# Altium project Dragonflyte.PrjPcb (part 2 of 2)

## Sheet UWB.SchDoc
size A
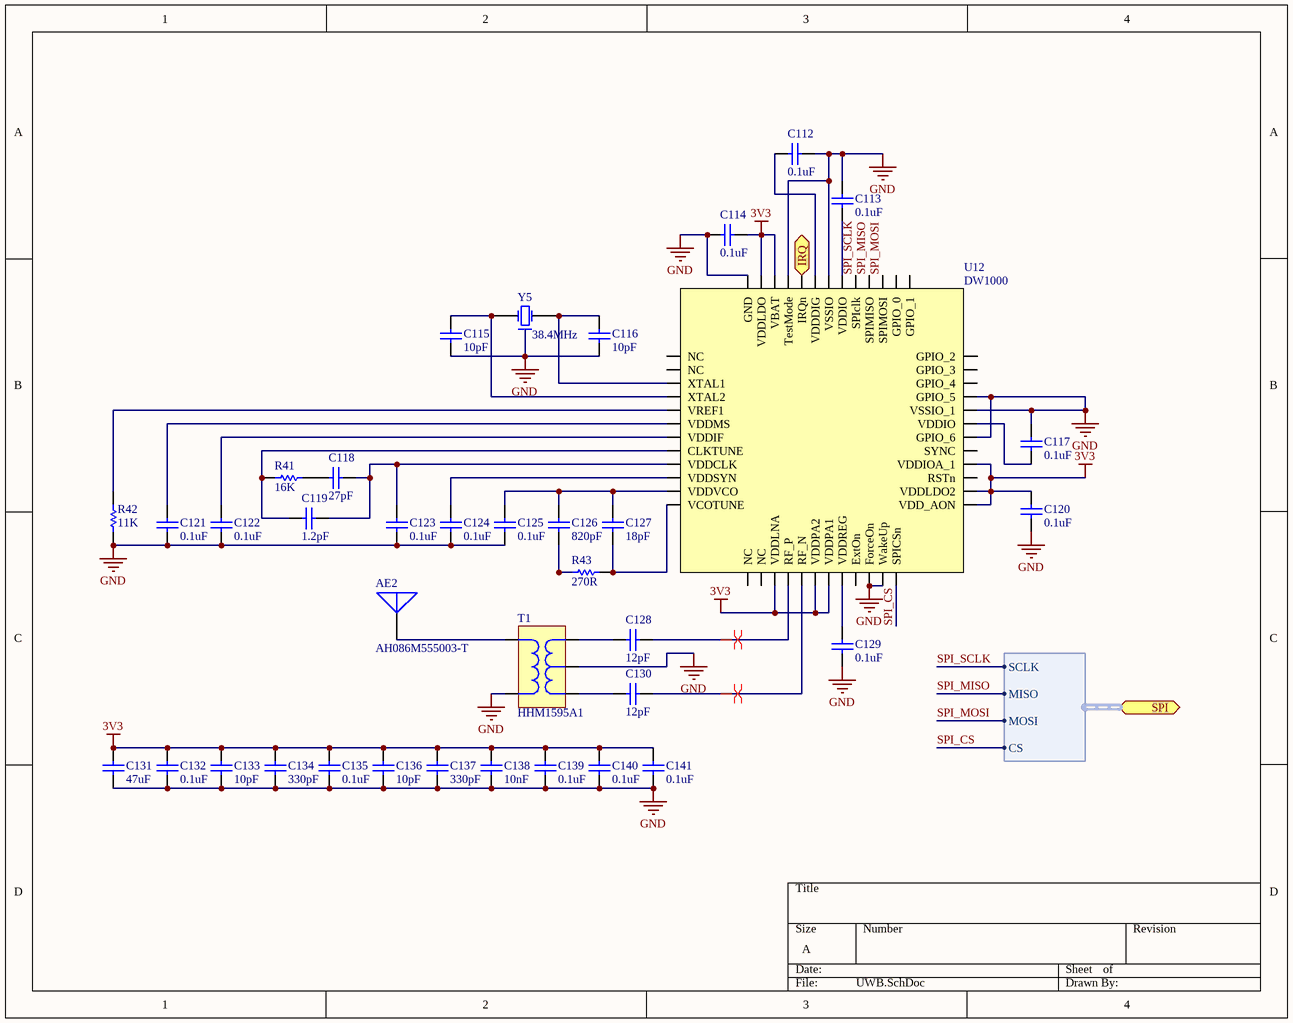
[diagram p8: UWB.SchDoc]

### Parts
AE2  AH086M555003-T  [AH086M555003-T]
C112  value 0.1uF  [C0402[1005X55]]  (hidden comment: 0.1uF 6.3V 0402)
C113  value 0.1uF  [C0402[1005X55]]  (hidden comment: 0.1uF 6.3V 0402)
C114  value 0.1uF  [C0402[1005X55]]  (hidden comment: 0.1uF 6.3V 0402)
C115  value 10pF  [C0402[1005X55]]  (hidden comment: 10pF 50V 0402)
C116  value 10pF  [C0402[1005X55]]  (hidden comment: 10pF 50V 0402)
C117  value 0.1uF  [C0402[1005X55]]  (hidden comment: 0.1uF 6.3V 0402)
C118  value 27pF  [C0402[1005X55]]  (hidden comment: 27pF 50V 0402)
C119  value 1.2pF  [C0402[1005X55]]  (hidden comment: 1.2pF 50V 0402)
C120  value 0.1uF  [C0402[1005X55]]  (hidden comment: 0.1uF 6.3V 0402)
C121  value 0.1uF  [C0402[1005X55]]  (hidden comment: 0.1uF 6.3V 0402)
C122  value 0.1uF  [C0402[1005X55]]  (hidden comment: 0.1uF 6.3V 0402)
C123  value 0.1uF  [C0402[1005X55]]  (hidden comment: 0.1uF 6.3V 0402)
C124  value 0.1uF  [C0402[1005X55]]  (hidden comment: 0.1uF 6.3V 0402)
C125  value 0.1uF  [C0402[1005X55]]  (hidden comment: 0.1uF 6.3V 0402)
C126  value 820pF  [C0402[1005X55]]  (hidden comment: 820pF 50V 0402)
C127  value 18pF  [C0402[1005X55]]  (hidden comment: 18pF 50V 0402)
C128  value 12pF  [C0402[1005X55]]  (hidden comment: 12pF 50V 0402)
C129  value 0.1uF  [C0402[1005X55]]  (hidden comment: 0.1uF 6.3V 0402)
C130  value 12pF  [C0402[1005X55]]  (hidden comment: 12pF 50V 0402)
C131  value 47uF  [C1206[3216X160]]  (hidden comment: 47uF 6.3V 1206)
C132  value 0.1uF  [C0402[1005X55]]  (hidden comment: 0.1uF 6.3V 0402)
C133  value 10pF  [C0402[1005X55]]  (hidden comment: 10pF 50V 0402)
C134  value 330pF  [C0402[1005X55]]  (hidden comment: 330pF 50V 0402)
C135  value 0.1uF  [C0402[1005X55]]  (hidden comment: 0.1uF 6.3V 0402)
C136  value 10pF  [C0402[1005X55]]  (hidden comment: 10pF 50V 0402)
C137  value 330pF  [C0402[1005X55]]  (hidden comment: 330pF 50V 0402)
C138  value 10nF  [C0402[1005X55]]  (hidden comment: 10nF 50V 0402)
C139  value 0.1uF  [C0402[1005X55]]  (hidden comment: 0.1uF 6.3V 0402)
C140  value 0.1uF  [C0402[1005X55]]  (hidden comment: 0.1uF 6.3V 0402)
C141  value 0.1uF  [C0402[1005X55]]  (hidden comment: 0.1uF 6.3V 0402)
R41  value 16K  [R0402[1005]]  (hidden comment: 16K 1% 0402)
R42  value 11K  [R0402[1005]]  (hidden comment: 11K 1% 0402)
R43  value 270R  [R0402[1005]]  (hidden comment: 270R 1% 0402)
T1  HHM1595A1  [HHM1595A1]
U12  DW1000  [QFN-48]
Y5  38.4MHz  [ABRA-ABM10]

### Ports
IRQ (out), SPI (harness SPI)

### Harnesses
SPI: SCLK, MISO, MOSI, CS

### Nets
3V3: C114.1 C120.2 C131.2 C132.2 C133.2 C134.2 C135.2 C136.2 C137.2 C138.2 C139.2 C140.2 C141.2 U12.15(VDDLNA) U12.18(VDDPA2) U12.19(VDDPA1) U12.25(VDD_AON) U12.26(VDDLDO2) U12.28(VDDIOA_1) U12.47(VBAT) U12.48(VDDLDO)
GND: C112.1 C113.2 C114.2 C115.1 C116.1 C117.2 C120.1 C121.1 C122.1 C123.1 C124.1 C125.1 C129.1 C131.1 C132.1 C133.1 C134.1 C135.1 C136.1 C137.1 C138.1 C139.1 C140.1 C141.1 R42.1 T1.2 T1.5 U12.22(ForceOn) U12.23(WakeUp) U12.30(GPIO_6) U12.32(VSSIO_1) U12.33(GPIO_5) U12.43(VSSIO) U12.46(TestMode) U12.49(GND) Y5.2
SPI_CS: U12.24(SPICSn) ; port SPI.CS
SPI_MISO: U12.40(SPIMISO) ; port SPI.MISO
SPI_MOSI: U12.39(SPIMOSI) ; port SPI.MOSI
SPI_SCLK: U12.41(SPIclk) ; port SPI.SCLK
NetAE2_1: AE2.1 T1.1
NetC112_2: C112.2 U12.44(VDDDIG)
NetC113_1: C113.1 U12.42(VDDIO)
NetC115_2: C115.2 U12.4(XTAL2) Y5.1(X1)
NetC116_2: C116.2 U12.3(XTAL1) Y5.3(X2)
NetC117_1: C117.1 U12.31(VDDIO)
NetC118_1: C118.1 C119.1 C123.2 U12.9(VDDCLK)
NetC118_2: C118.2 R41.1
NetC119_2: C119.2 R41.2 U12.8(CLKTUNE)
NetC121_2: C121.2 U12.6(VDDMS)
NetC122_2: C122.2 U12.7(VDDIF)
NetC124_2: C124.2 U12.10(VDDSYN)
NetC125_2: C125.2 C126.2 C127.2 U12.11(VDDVCO)
NetC126_1: C126.1 R43.1
NetC127_1: C127.1 R43.2 U12.12(VCOTUNE)
NetC128_1: C128.1 T1.4
NetC128_2: C128.2 U12.16(RF_P)
NetC129_2: C129.2 U12.20(VDDREG)
NetC130_1: C130.1 T1.3
NetC130_2: C130.2 U12.17(RF_N)
NetR42_2: R42.2 U12.5(VREF1)
NetU1_A16: U12.45(IRQn) ; port IRQ

Not connected (* = marked no-connect by the designer): U12 1(NC) 2(NC) 13(NC) 14(NC) 21(ExtOn) 27(RSTn) 29(SYNC) 34(GPIO_4) 35(GPIO_3) 36(GPIO_2) 37(GPIO_1) 38(GPIO_0)

### Layout directives
differential pair: NetC128_2, NetC130_2

### Library data of the parts
AE2 = AH086M555003-T: Manufacturer: Taiyo Yuden; PartNumber: AH086M555003-T; Mounting Technology: Surface Mount
C112-C114 C117 C120-C125 C129 C132 C135 C139-C141 = CAP_0.1uF_6.3V_0402_10%: 0.1uF 6.3V 10% 0402 (1005 Metric); PartNumber: GRM155R70J104KA01D; Manufacturer: Murata; Mounting Technology: Surface Mount; PackageReference: 0402; PackageDescription: 0402 (1005 Metric); Voltage: 6.3V; Tolerance: 10%
C115 C116 C133 C136 = CAP_10pF_50V_0402_1%: 10pF 50V 1% 0402 (1005 Metric); PartNumber: GRM1555C1H100FA01D; Manufacturer: Murata; Mounting Technology: Surface Mount; PackageReference: 0402; PackageDescription: 0402 (1005 Metric); Voltage: 50V; Tolerance: 1%
C118 = CAP_27pF_50V_0402_1%: 27pF 50V 1% 0402 (1005 Metric); PartNumber: GRM1555C1H270FA01D; Manufacturer: Murata; Mounting Technology: Surface Mount; PackageReference: 0402; PackageDescription: 0402 (1005 Metric); Voltage: 50V; Tolerance: 1%
C119 = CAP_1.2pF_50V_0402_0.05pF: 1.2pF 50V 0.05pF 0402 (1005 Metric); PartNumber: GRM1555C1H1R2WA01D; Manufacturer: Murata; Mounting Technology: Surface Mount; PackageReference: 0402; PackageDescription: 0402 (1005 Metric); Voltage: 50V; Tolerance: 0.05pF
C126 = CAP_820pF_50V_0402_5%: 820pF 50V 5% 0402 (1005 Metric); PartNumber: GRM1555C1H821JA01D; Manufacturer: Murata; Mounting Technology: Surface Mount; PackageReference: 0402; PackageDescription: 0402 (1005 Metric); Voltage: 50V; Tolerance: 5%
C127 = CAP_18pF_50V_0402_1%: 18pF 50V 1% 0402 (1005 Metric); PartNumber: GRM1555C1H180FA01D; Manufacturer: Murata; Mounting Technology: Surface Mount; PackageReference: 0402; PackageDescription: 0402 (1005 Metric); Voltage: 50V; Tolerance: 1%
C128 C130 = CAP_12pF_50V_0402_5%: 12pF 50V 5% 0402 (1005 Metric); PartNumber: GRM1555C1H120JA01D; Manufacturer: Murata; Mounting Technology: Surface Mount; PackageReference: 0402; PackageDescription: 0402 (1005 Metric); Voltage: 50V; Tolerance: 5%
C131 = CAP_47uF_6.3V_1206_10%: 47uF 6.3V 10% 1206 (3216 Metric); PartNumber: GRM31CR60J476KE19L; Manufacturer: Murata; Mounting Technology: Surface Mount; PackageReference: 1206; PackageDescription: 1206 (3216 Metric); Voltage: 6.3V; Tolerance: 10%
C134 C137 = CAP_330pF_50V_0402_5%: 330pF 50V 5% 0402 (1005 Metric); PartNumber: GRM1555C1H331JA01D; Manufacturer: Murata; Mounting Technology: Surface Mount; PackageReference: 0402; PackageDescription: 0402 (1005 Metric); Voltage: 50V; Tolerance: 5%
C138 = CAP_10nF_50V_0402_10%: 10nF 50V 10% 0402 (1005 Metric); PartNumber: GCM155R71H103KA55D; Manufacturer: Murata; Mounting Technology: Surface Mount; PackageReference: 0402; PackageDescription: 0402 (1005 Metric); Voltage: 50V; Tolerance: 10%
R41 = RES_16K_0402_1%: 16K 0.063W 1% 0402 (1005 Metric); Manufacturer: KOA Speer; PartNumber: RK73H1ETTP1602F; Tolerance: 1%; Power: 0.063W; Mounting Technology: Surface Mount; PackageReference: 0402; PackageDescription: 0402 (1005 Metric); ComponentLink1Description: Datasheet; ComponentLink1URL: http://www.koaspeer.com/catimages/Products/RK73H/RK73H.pdf
R42 = RES_11K_0402_1%: 11K 0.063W 1% 0402 (1005 Metric); Manufacturer: KOA Speer; PartNumber: RK73H1ETTP1102F; Tolerance: 1%; Power: 0.063W; Mounting Technology: Surface Mount; PackageReference: 0402; PackageDescription: 0402 (1005 Metric); ComponentLink1Description: Datasheet; ComponentLink1URL: http://www.koaspeer.com/catimages/Products/RK73H/RK73H.pdf
R43 = RES_270R_0402_1%: 270R 0.063W 1% 0402 (1005 Metric); Manufacturer: KOA Speer; PartNumber: RK73H1ETTP2700F; Tolerance: 1%; Power: 0.063W; Mounting Technology: Surface Mount; PackageReference: 0402; PackageDescription: 0402 (1005 Metric); ComponentLink1Description: Datasheet; ComponentLink1URL: http://www.koaspeer.com/catimages/Products/RK73H/RK73H.pdf
T1 = HHM1595A1: Manufacturer: TDK; PartNumber: HHM1595A1; PackageReference: 0805; Mounting Technology: Surface Mount
U12 = DW1000: UWB DW1000; Part Number: DW1000-I-TR13; Manufacturer: Decawave Limited; PackageReference: QFN-48; Mounting Technology: Surface Mount
Y5 = ABM10-165-38.400MHZ-T3: Manufacturer: ABRACON; PartNumber: ABM10-165-38.400MHZ-T3; Mounting Technology: Surface Mount; PackageReference: 4-SMD; PackageDescription: 4-SMD, No Lead (DFN, LCC)

## Sheet MicrophoneArray.SchDoc
size A
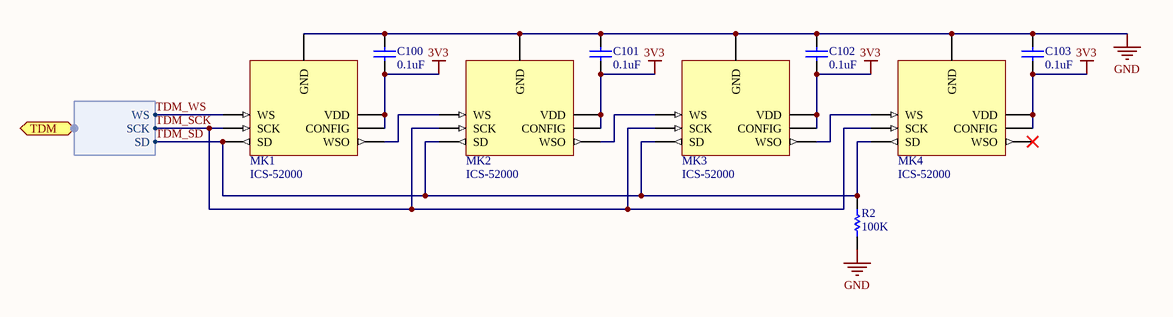
[diagram p9: MicrophoneArray.SchDoc]

### Parts
C100  value 0.1uF  [C0402[1005X55]]  (hidden comment: 0.1uF 6.3V 0402)
C101  value 0.1uF  [C0402[1005X55]]  (hidden comment: 0.1uF 6.3V 0402)
C102  value 0.1uF  [C0402[1005X55]]  (hidden comment: 0.1uF 6.3V 0402)
C103  value 0.1uF  [C0402[1005X55]]  (hidden comment: 0.1uF 6.3V 0402)
MK1  ICS-52000  [MIC]
MK2  ICS-52000  [MIC]
MK3  ICS-52000  [MIC]
MK4  ICS-52000  [MIC]
R2  value 100K  [R0402[1005]]  (hidden comment: 100K 1% 0402)

### Ports
TDM (harness TDM)

### Harnesses
TDM: WS, SCK, SD

### Nets
3V3: C100.1 C101.1 C102.1 C103.1 MK1.2(CONFIG) MK1.3(VDD) MK2.2(CONFIG) MK2.3(VDD) MK3.2(CONFIG) MK3.3(VDD) MK4.2(CONFIG) MK4.3(VDD)
GND: C100.2 C101.2 C102.2 C103.2 MK1.4(GND) MK2.4(GND) MK3.4(GND) MK4.4(GND) R2.1
TDM_SCK: MK1.6(SCK) MK2.6(SCK) MK3.6(SCK) MK4.6(SCK) ; port TDM.SCK
TDM_SD: MK1.7(SD) MK2.7(SD) MK3.7(SD) MK4.7(SD) R2.2 ; port TDM.SD
TDM_WS: MK1.5(WS) ; port TDM.WS
NetMK1_1: MK1.1(WSO) MK2.5(WS)
NetMK2_1: MK2.1(WSO) MK3.5(WS)
NetMK3_1: MK3.1(WSO) MK4.5(WS)

Not connected (* = marked no-connect by the designer): MK4 1(WSO)*

### Library data of the parts
C100-C103 = CAP_0.1uF_6.3V_0402_10%: as C112 on sheet UWB; Mounting Technology: Surface Mount; PackageReference: 0402; PackageDescription: 0402 (1005 Metric); Voltage: 6.3V; Tolerance: 10%
MK1-MK4 = ICS-52000: MIC MEMS DIGITAL OMNI -26DB; Manufacturer: TDK InvenSense; PartNumber: ICS-52000; Mounting Technology: Surface Mount
R2 = RES_100K_0402_1%: 100K 0.063W 1% 0402 (1005 Metric); Manufacturer: KOA Speer; PartNumber: RK73H1ETTP1003F; Tolerance: 1%; Power: 0.063W; Mounting Technology: Surface Mount; PackageReference: 0402; PackageDescription: 0402 (1005 Metric); ComponentLink1Description: Datasheet; ComponentLink1URL: http://www.koaspeer.com/catimages/Products/RK73H/RK73H.pdf

## Sheet Cameras.SchDoc
size B
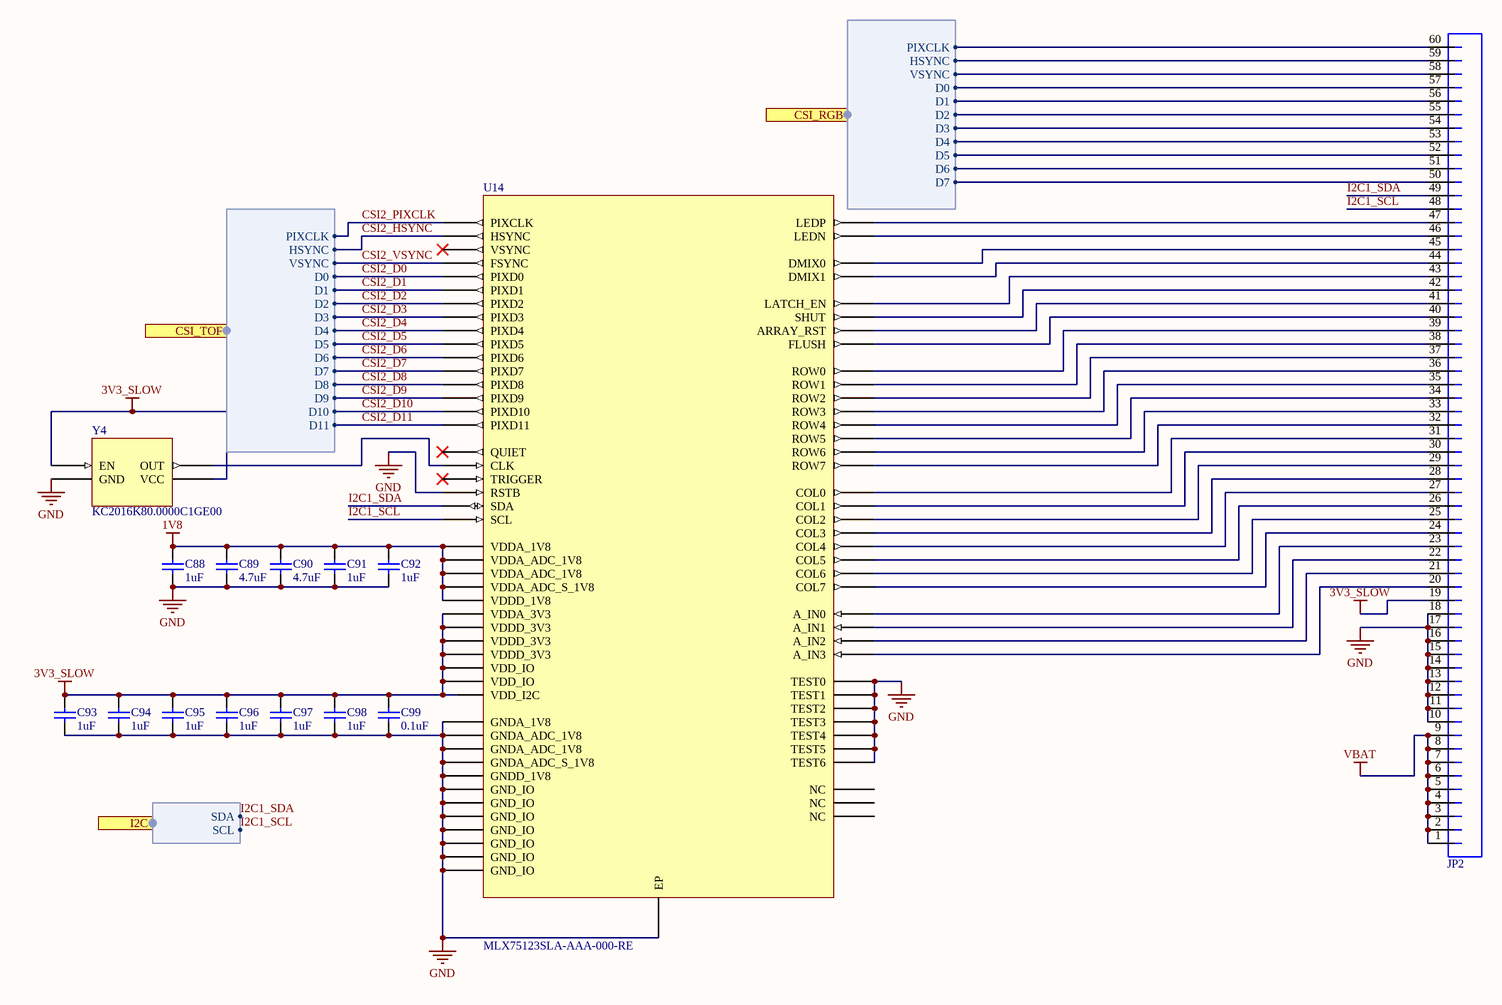
[diagram p10: Cameras.SchDoc]

### Parts
C88  value 1uF  [C0402[1005X55]]  (hidden comment: 1uF 6.3V 0402)
C89  value 4.7uF  [C0402[1005X55]]  (hidden comment: 4.7uF 6.3V 0402)
C90  value 4.7uF  [C0402[1005X55]]  (hidden comment: 4.7uF 6.3V 0402)
C91  value 1uF  [C0402[1005X55]]  (hidden comment: 1uF 6.3V 0402)
C92  value 1uF  [C0402[1005X55]]  (hidden comment: 1uF 6.3V 0402)
C93  value 1uF  [C0402[1005X55]]  (hidden comment: 1uF 6.3V 0402)
C94  value 1uF  [C0402[1005X55]]  (hidden comment: 1uF 6.3V 0402)
C95  value 1uF  [C0402[1005X55]]  (hidden comment: 1uF 6.3V 0402)
C96  value 1uF  [C0402[1005X55]]  (hidden comment: 1uF 6.3V 0402)
C97  value 1uF  [C0402[1005X55]]  (hidden comment: 1uF 6.3V 0402)
C98  value 1uF  [C0402[1005X55]]  (hidden comment: 1uF 6.3V 0402)
C99  value 0.1uF  [C0402[1005X55]]  (hidden comment: 0.1uF 6.3V 0402)
JP2  JST_JMD_60_HORZ  [JST-JMD-60-SMD-HORZ]  (value not drawn)
U14  MLX75123SLA-AAA-000-RE  [AQFN-84]
Y4  KC2016K80.0000C1GE00  [KC2016K]

### Ports
CSI_RGB (harness CSI8), CSI_TOF (harness CSI12), I2C (harness I2C)

### Harnesses
CSI12: D2, D3, D1, D0, D6, D7, D5, D4, D10, D9, D8, PIXCLK, D11, HSYNC, VSYNC
I2C: SCL, SDA
CSI8: D2, D3, D1, D0, D6, D7, D5, D4, PIXCLK, HSYNC, VSYNC

### Nets
1V8: C88.2 C89.2 C90.2 C91.2 C92.2 U14.A9(VDDA_ADC_1V8) U14.A10(VDDA_ADC_S_1V8) U14.B5(VDDA_ADC_1V8) U14.B14(VDDA_1V8) U14.B20(VDDD_1V8)
3V3_SLOW: C93.2 C94.2 C95.2 C96.2 C97.2 C98.2 C99.2 JP2.19 U14.A36(VDDD_3V3) U14.B4(VDDA_3V3) U14.B12(VDD_I2C) U14.B17(VDDD_3V3) U14.B21(VDD_IO) U14.B30(VDD_IO) U14.B38(VDDD_3V3) Y4.1(EN) Y4.4(VCC)
GND: C88.1 C89.1 C90.1 C91.1 C92.1 C93.1 C94.1 C95.1 C96.1 C97.1 C98.1 C99.1 JP2.10 JP2.11 JP2.12 JP2.13 JP2.14 JP2.15 JP2.16 JP2.17 JP2.18 U14.A5(GNDA_ADC_1V8) U14.A8(GND_IO) U14.A11(TEST5) U14.A14(RSTB) U14.A16(GNDA_1V8) U14.A17(TEST3) U14.A18(GND_IO) U14.A21(TEST0) U14.A22(GNDD_1V8) U14.A24(GND_IO) U14.A33(GND_IO) U14.A41(GND_IO) U14.B8(GNDA_ADC_1V8) U14.B9(GNDA_ADC_S_1V8) U14.B10(TEST6) U14.B15(GND_IO) U14.B16(TEST4) U14.B18(TEST2) U14.B19(TEST1) U14.B33(GND_IO) U14.EP Y4.2(GND)
VBAT: JP2.1 JP2.2 JP2.3 JP2.4 JP2.5 JP2.6 JP2.7 JP2.8 JP2.9
CSI1_D0: JP2.57 ; port CSI_RGB.D0
CSI1_D1: JP2.56 ; port CSI_RGB.D1
CSI1_D2: JP2.55 ; port CSI_RGB.D2
CSI1_D3: JP2.54 ; port CSI_RGB.D3
CSI1_D4: JP2.53 ; port CSI_RGB.D4
CSI1_D5: JP2.52 ; port CSI_RGB.D5
CSI1_D6: JP2.51 ; port CSI_RGB.D6
CSI1_D7: JP2.50 ; port CSI_RGB.D7
CSI1_HSYNC: JP2.59 ; port CSI_RGB.HSYNC
CSI1_PIXCLK: JP2.60 ; port CSI_RGB.PIXCLK
CSI1_VSYNC: JP2.58 ; port CSI_RGB.VSYNC
CSI2_D0: U14.A30(PIXD0) ; port CSI_TOF.D0
CSI2_D1: U14.B27(PIXD1) ; port CSI_TOF.D1
CSI2_D2: U14.A29(PIXD2) ; port CSI_TOF.D2
CSI2_D3: U14.B26(PIXD3) ; port CSI_TOF.D3
CSI2_D4: U14.A28(PIXD4) ; port CSI_TOF.D4
CSI2_D5: U14.B25(PIXD5) ; port CSI_TOF.D5
CSI2_D6: U14.A27(PIXD6) ; port CSI_TOF.D6
CSI2_D7: U14.B24(PIXD7) ; port CSI_TOF.D7
CSI2_D8: U14.A26(PIXD8) ; port CSI_TOF.D8
CSI2_D9: U14.B23(PIXD9) ; port CSI_TOF.D9
CSI2_D10: U14.A25(PIXD10) ; port CSI_TOF.D10
CSI2_D11: U14.B22(PIXD11) ; port CSI_TOF.D11
CSI2_HSYNC: U14.B29(HSYNC) ; port CSI_TOF.HSYNC
CSI2_PIXCLK: U14.B28(PIXCLK) ; port CSI_TOF.PIXCLK
CSI2_VSYNC: U14.A31(FSYNC) ; port CSI_TOF.VSYNC
I2C1_SCL: JP2.48 U14.A12(SCL) ; port I2C.SCL
I2C1_SDA: JP2.49 U14.B11(SDA) ; port I2C.SDA
NetJP2_20: JP2.20 U14.B7(A_IN3)
NetJP2_21: JP2.21 U14.A7(A_IN2)
NetJP2_22: JP2.22 U14.A6(A_IN1)
NetJP2_23: JP2.23 U14.B6(A_IN0)
NetJP2_24: JP2.24 U14.A37(COL7)
NetJP2_25: JP2.25 U14.B34(COL6)
NetJP2_26: JP2.26 U14.A38(COL5)
NetJP2_27: JP2.27 U14.B35(COL4)
NetJP2_28: JP2.28 U14.A39(COL3)
NetJP2_29: JP2.29 U14.B36(COL2)
NetJP2_30: JP2.30 U14.A40(COL1)
NetJP2_31: JP2.31 U14.B37(COL0)
NetJP2_32: JP2.32 U14.A2(ROW7)
NetJP2_33: JP2.33 U14.B1(ROW6)
NetJP2_34: JP2.34 U14.A1(ROW5)
NetJP2_35: JP2.35 U14.A44(ROW4)
NetJP2_36: JP2.36 U14.B40(ROW3)
NetJP2_37: JP2.37 U14.A43(ROW2)
NetJP2_38: JP2.38 U14.B39(ROW1)
NetJP2_39: JP2.39 U14.A42(ROW0)
NetJP2_40: JP2.40 U14.B3(FLUSH)
NetJP2_41: JP2.41 U14.A3(ARRAY_RST)
NetJP2_42: JP2.42 U14.B2(SHUT)
NetJP2_43: JP2.43 U14.A4(LATCH_EN)
NetJP2_44: JP2.44 U14.B32(DMIX1)
NetJP2_45: JP2.45 U14.A35(DMIX0)
NetJP2_46: JP2.46 U14.A34(LEDN)
NetJP2_47: JP2.47 U14.B31(LEDP)
NetU14_B13: U14.B13(CLK) Y4.3(OUT)

Not connected (* = marked no-connect by the designer): U14 A13(TRIGGER)* A15(QUIET)* A19(NC) A20(NC) A23(NC) A32(VSYNC)*

### Library data of the parts
C88 C91-C98 = CAP_1uF_6.3V_0402_10%: 1uF 6.3V 10% 0402 (1005 Metric); PartNumber: GRM155R70J105KA12D; Manufacturer: Murata; Mounting Technology: Surface Mount; PackageReference: 0402; PackageDescription: 0402 (1005 Metric); Voltage: 6.3V; Tolerance: 10%
C89 C90 = CAP_4.7uF_6.3V_0402_20%: 4.7uF 6.3V 20% 0402 (1005 Metric); PartNumber: GRM155R60J475ME47D; Manufacturer: Murata; Mounting Technology: Surface Mount; PackageReference: 0402; PackageDescription: 0402 (1005 Metric); Voltage: 6.3V; Tolerance: 20%
C99 = CAP_0.1uF_6.3V_0402_10%: as C112 on sheet UWB; Mounting Technology: Surface Mount; PackageReference: 0402; PackageDescription: 0402 (1005 Metric); Voltage: 6.3V; Tolerance: 10%
JP2 = JST_JMD_60_HORZ: Manufacturer: JST Sales America, Inc.; PartNumber: 60PS-JMDSS-G-1-TF; PackageReference: JMD-60; Mounting Technology: Surface Mount
U14 = MLX75123SLA-AAA-000-RE: Sensor Interface ToF Companion Chip; Manufacturer: Melexis; PackageReference: AQFN-84; Mounting Technology: Surface Mount; PartNumber: MLX75123SLA-AAA-000-RE
Y4 = KC2016K80.0000C1GE00: OSC XO 80.0000MHZ CMOS SMD; Manufacturer: AVX; PartNumber: KC2016K80.0000C1GE00; Mounting Technology: Surface Mount; PackageReference: SMD-4

## Sheet PowerBoardConnector.SchDoc
size A; DocumentNumber: 13; SheetNumber: 13
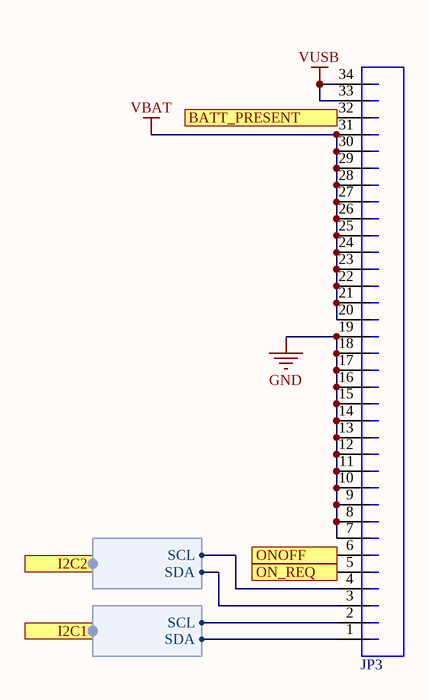
[diagram p11: PowerBoardConnector.SchDoc]

### Parts
JP3  MOLEX_FFC-FPC_34  [MOLEX-FFC-FPC-0.5MM-34]  (value not drawn)

### Ports
BATT_PRESENT (out), I2C1 (harness I2C), I2C2 (harness I2C), ON_REQ (in), ONOFF (out)

### Harnesses
I2C: SCL, SDA

### Nets
GND: JP3.7 JP3.8 JP3.9 JP3.10 JP3.11 JP3.12 JP3.13 JP3.14 JP3.15 JP3.16 JP3.17 JP3.18 JP3.19
VBAT: JP3.20 JP3.21 JP3.22 JP3.23 JP3.24 JP3.25 JP3.26 JP3.27 JP3.28 JP3.29 JP3.30 JP3.31
VUSB: JP3.33 JP3.34
I2C1_SCL: JP3.2 ; port I2C1.SCL
I2C1_SDA: JP3.1 ; port I2C1.SDA
I2C2_SCL: JP3.4 ; port I2C2.SCL
I2C2_SDA: JP3.3 ; port I2C2.SDA
NetJP3_5: JP3.5 ; port ON_REQ
NetJP3_6: JP3.6 ; port ONOFF
NetJP3_32: JP3.32 ; port BATT_PRESENT

### Library data of the parts
JP3 = MOLEX_FFC-FPC_34: Manufacturer: Molex; PartNumber: 51296-3494; PackageReference: FFC-FPC-0.5; Mounting Technology: Surface Mount

## Nets that join several sheets
1V4: Supplies (5 pins), MPU-Power (22 pins), MPU-Control (R5.2)
1V8: Supplies (C63.2 L2.2 U7.1), Cameras (10 pins)
3V3: Supplies (6 pins), MPU-Power (5 pins), MPU-Control (R4.2 SW1.1 SW1.2 U4.1), WiFi (C76.2 U9.30), Sensors (22 pins), UWB (21 pins), MicrophoneArray (12 pins)
3V3_SLOW: Supplies (C65.1 L3.2 U7.10), MPU-Control (U1.T9), MPU-Peripherals (30 pins), WiFi (C74.1 U9.36), USB (6 pins), Cameras (17 pins)
GND: Supplies (29 pins), MPU-Power (94 pins), MPU-Control (15 pins), MPU-Peripherals (13 pins), WiFi (18 pins), USB (17 pins), Sensors (28 pins), UWB (36 pins), MicrophoneArray (9 pins), Cameras (43 pins), PowerBoardConnector (13 pins)
VBAT: Supplies (U13.8), Cameras (9 pins), PowerBoardConnector (12 pins)
VMUX: Supplies (12 pins), MPU-Peripherals (LS1.1)
VUSB: Supplies (U13.6), MPU-Peripherals (C32.2 U1.W20), USB (C77.1 JP1.1 R30.2 U10.4), PowerBoardConnector (JP3.33 JP3.34)
CSI1_D0: MPU-Peripherals (U1.M20), Cameras (JP2.57)
CSI1_D1: MPU-Peripherals (U1.H20), Cameras (JP2.56)
CSI1_D2: MPU-Peripherals (U1.H16), Cameras (JP2.55)
CSI1_D3: MPU-Peripherals (U1.K17), Cameras (JP2.54)
CSI1_D4: MPU-Peripherals (U1.K16), Cameras (JP2.53)
CSI1_D5: MPU-Peripherals (U1.K15), Cameras (JP2.52)
CSI1_D6: MPU-Peripherals (U1.L16), Cameras (JP2.51)
CSI1_D7: MPU-Peripherals (U1.K19), Cameras (JP2.50)
CSI1_HSYNC: MPU-Peripherals (U1.M15), Cameras (JP2.59)
CSI1_PIXCLK: MPU-Peripherals (U1.M16), Cameras (JP2.60)
CSI1_VSYNC: MPU-Peripherals (U1.N19), Cameras (JP2.58)
CSI2_D0: MPU-Peripherals (U1.D10), Cameras (U14.A30)
CSI2_D1: MPU-Peripherals (U1.B8), Cameras (U14.B27)
CSI2_D2: MPU-Peripherals (U1.C11), Cameras (U14.A29)
CSI2_D3: MPU-Peripherals (U1.A9), Cameras (U14.B26)
CSI2_D4: MPU-Peripherals (U1.A11), Cameras (U14.A28)
CSI2_D5: MPU-Peripherals (U1.D11), Cameras (U14.B25)
CSI2_D6: MPU-Peripherals (U1.B9), Cameras (U14.A27)
CSI2_D7: MPU-Peripherals (U1.A12), Cameras (U14.B24)
CSI2_D8: MPU-Peripherals (U1.A10), Cameras (U14.A26)
CSI2_D9: MPU-Peripherals (U1.C12), Cameras (U14.B23)
CSI2_D10: MPU-Peripherals (U1.E8), Cameras (U14.A25)
CSI2_D11: MPU-Peripherals (U1.A7), Cameras (U14.B22)
CSI2_HSYNC: MPU-Peripherals (U1.B12), Cameras (U14.B29)
CSI2_PIXCLK: MPU-Peripherals (U1.B11), Cameras (U14.B28)
CSI2_VSYNC: MPU-Peripherals (U1.B10), Cameras (U14.A31)
I2C1_SCL: MPU-Peripherals (R20.1 U1.B20), Sensors (U19.1), Cameras (JP2.48 U14.A12), PowerBoardConnector (JP3.2)
I2C1_SDA: MPU-Peripherals (R21.1 U1.D19), Sensors (U19.6), Cameras (JP2.49 U14.B11), PowerBoardConnector (JP3.1)
I2C2_SCL: MPU-Peripherals (R36.1 U1.D13), Sensors (U15.23 U16.8 U17.10 U18.10), PowerBoardConnector (JP3.4)
I2C2_SDA: MPU-Peripherals (R35.1 U1.C13), Sensors (U15.24 U16.7 U17.9 U18.9), PowerBoardConnector (JP3.3)
NetJP3_5: MPU-Control (U1.P15), PowerBoardConnector (JP3.5)
NetJP3_6: MPU-Control (U1.U16), PowerBoardConnector (JP3.6)
NetJP3_32: Supplies (R39.1 U13.3), PowerBoardConnector (JP3.32)
NetR14_1: MPU-Peripherals (R14.1 U1.F12), WiFi (U9.22)
NetR15_1: MPU-Peripherals (R15.1 U1.E13), WiFi (U9.24)
NetR16_1: MPU-Peripherals (R16.1 U1.E14), WiFi (U9.26)
NetR17_1: MPU-Peripherals (R17.1 U1.F10), WiFi (U9.23)
NetR18_1: MPU-Peripherals (R18.1 U1.F11), WiFi (U9.25)
NetR19_2: MPU-Peripherals (R19.2), WiFi (U9.20)
NetR38_1: Supplies (U13.1), MPU-Peripherals (R38.1 U1.A17)
NetU1_A16: MPU-Peripherals (U1.A16), UWB (U12.45)
PWR_GOOD: Supplies (U7.8), MPU-Control (SW2.2 U4.4)
RESET: MPU-Control (C5.2 R4.1 U1.R16 U4.6), USB (U10.2 U11.15)
SPI_CS: MPU-Peripherals (U1.C14), UWB (U12.24)
SPI_MISO: MPU-Peripherals (U1.C15), UWB (U12.40)
SPI_MOSI: MPU-Peripherals (U1.E15), UWB (U12.39)
SPI_SCLK: MPU-Peripherals (U1.B16), UWB (U12.41)
TDM_SCK: MPU-Peripherals (U1.V6), MicrophoneArray (MK1.6 MK2.6 MK3.6 MK4.6)
TDM_SD: MPU-Peripherals (U1.T7), MicrophoneArray (5 pins)
TDM_WS: MPU-Peripherals (U1.W8), MicrophoneArray (MK1.5)
UART_RX: MPU-Peripherals (U1.B18), USB (U10.10)
UART_TX: MPU-Peripherals (U1.E16), USB (U10.7)
USB_OTG_N: MPU-Peripherals (U1.V19), USB (U11.2)
USB_OTG_P: MPU-Peripherals (U1.V20), USB (U11.3)